# Altium schematic sheet RGB_sensro_schematic.SchDoc: RGB Sensor Schematic
size 420 x 297 mm; Date: 10-Jun-2021; Author: Yasiru Senerath Karunanayaka; DrawnBy: Yasiru Senerath Karunanayaka; Engineer: Yasiru Senerath Karunanayaka; DocumentNumber: 1; Revision: 2.0; SheetNumber: 1; SheetTotal: 1
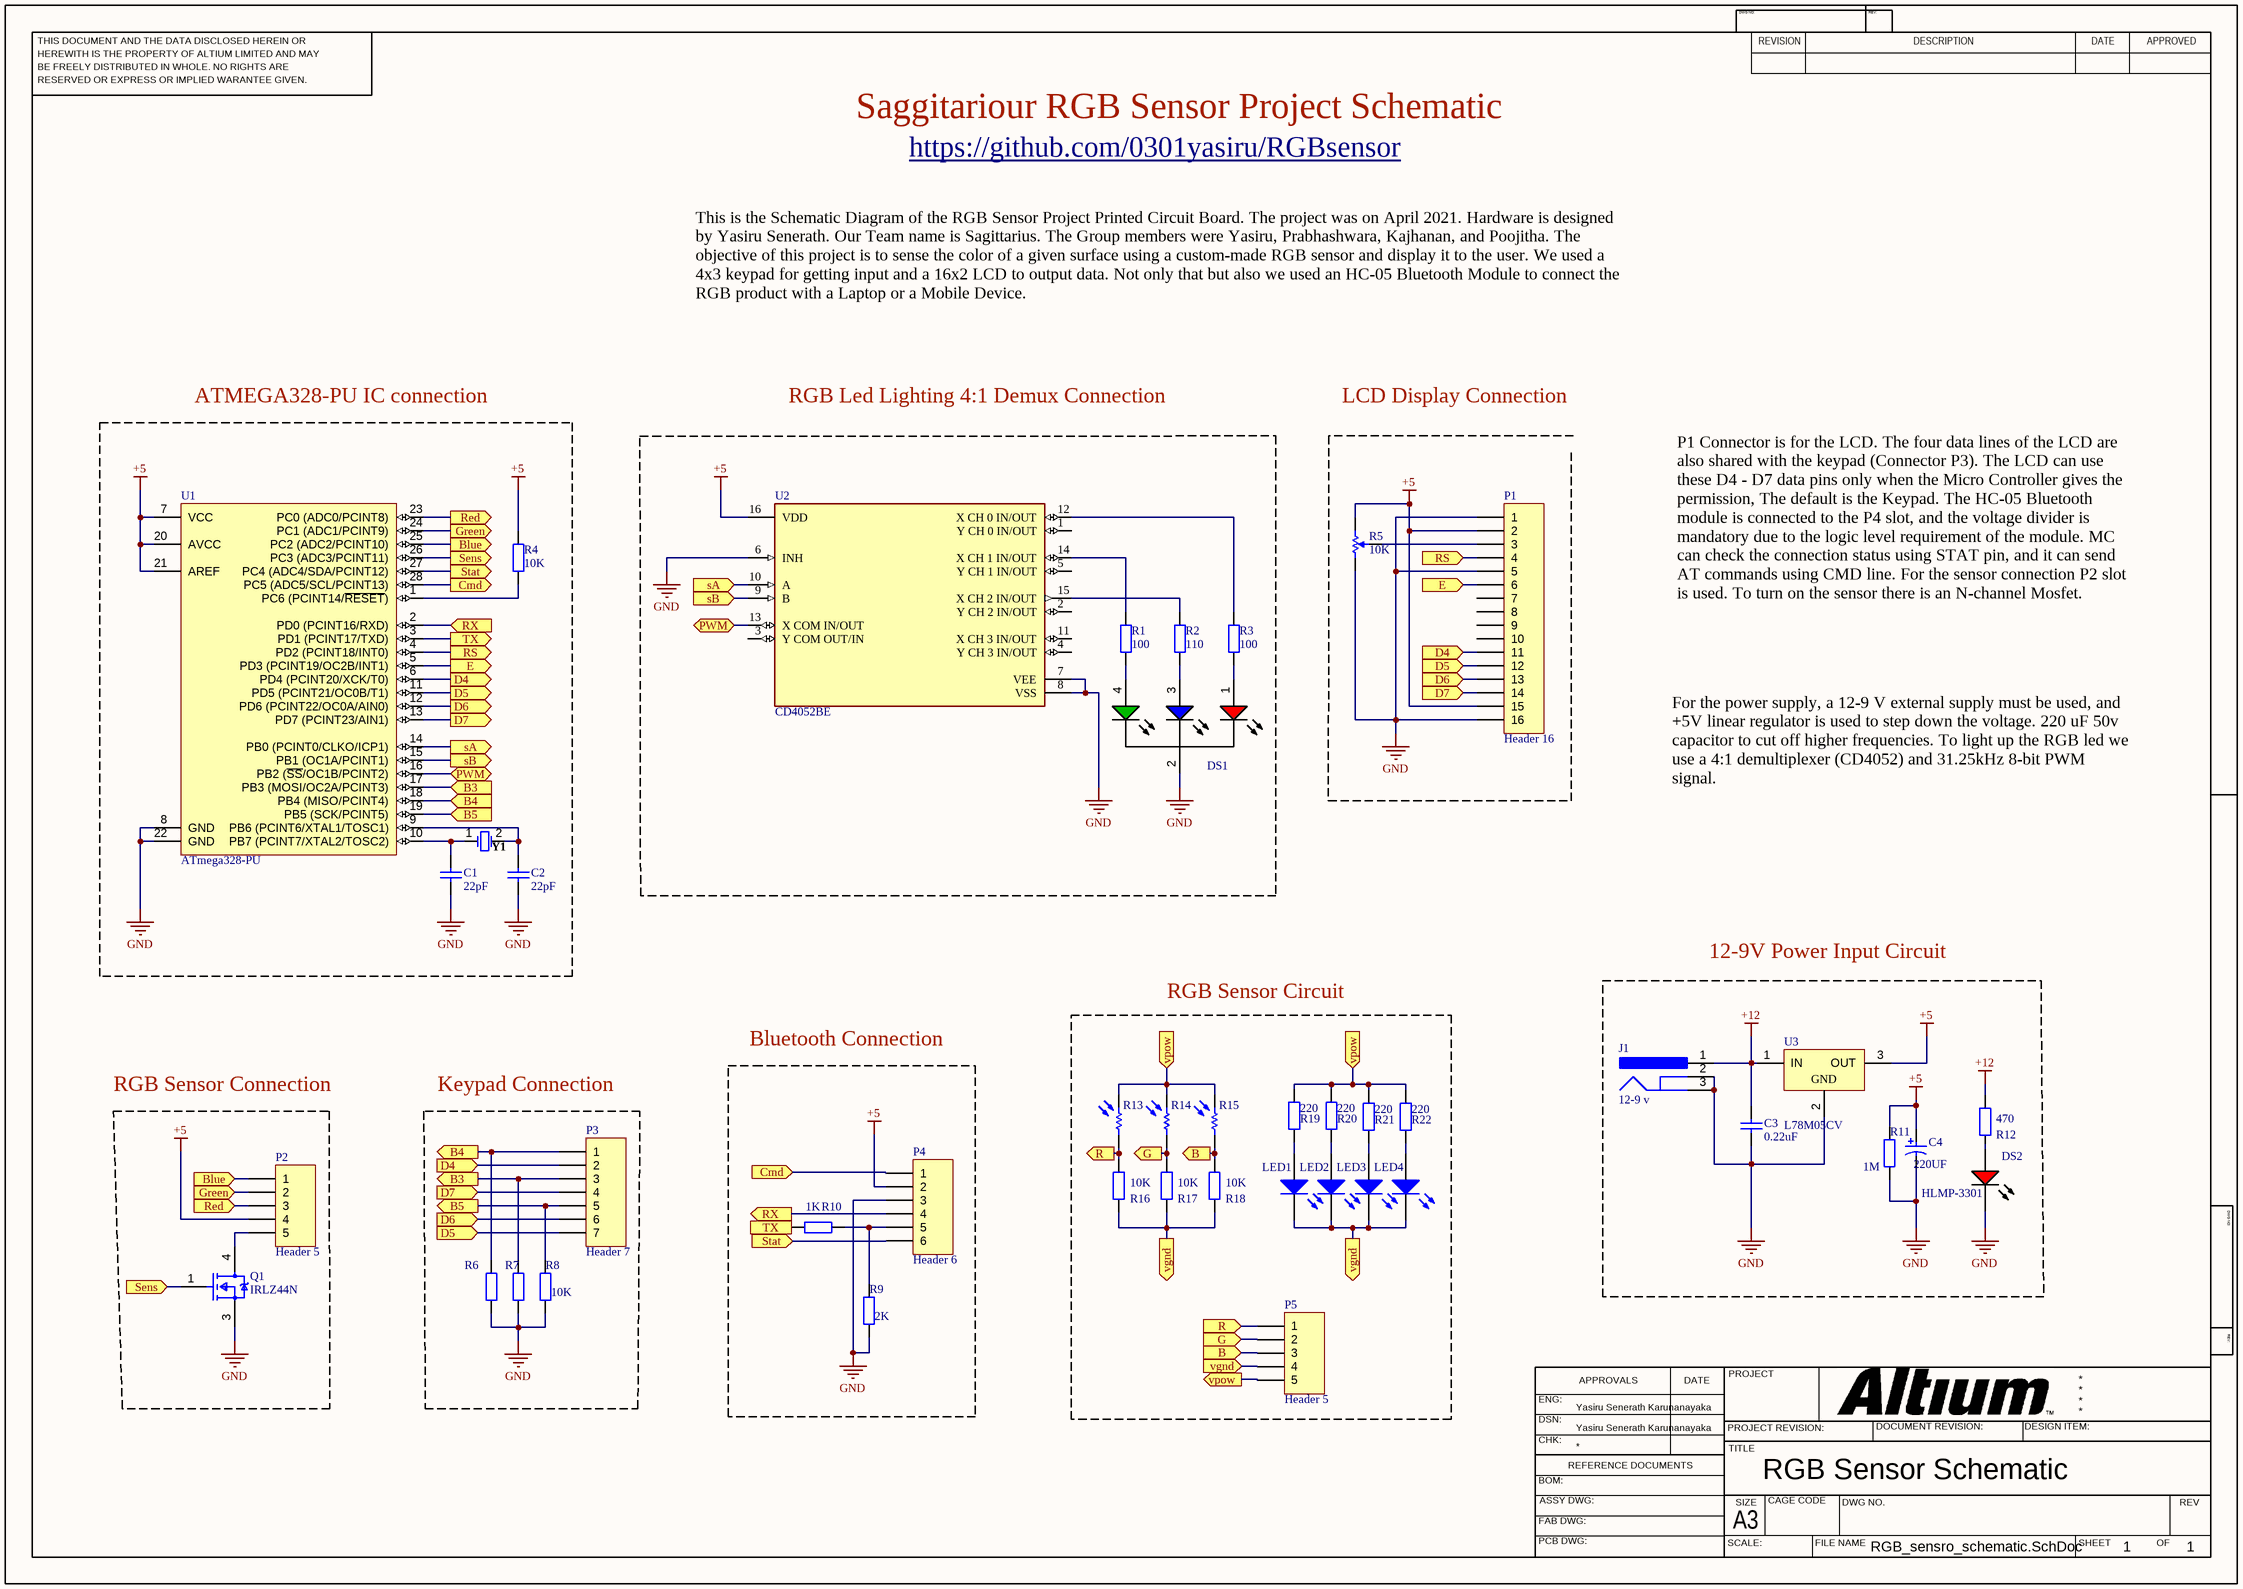
[diagram p0: RGB_sensro_schematic.SchDoc]

## Parts
C1  22pF  [KEMT-C315-THT-2]
C2  22pF  [KEMT-C315-THT-2]
C3  0.22uF  [KEMT-C315-THT-2]
C4  220UF  [PNSC-EEE-1HA221P_L]
DS1  (no value)  [KING-WP154A4SUREQBFZGC_V]
DS2  HLMP-3301  [AVAG-HLMP-3301-2]
J1  12-9 v  [LUMB-NEB21R_V]
LED1  151053RS03000  [Type 5mm]  (value not drawn)
LED2  151053RS03000  [Type 5mm]  (value not drawn)
LED3  151053RS03000  [Type 5mm]  (value not drawn)
LED4  151053RS03000  [Type 5mm]  (value not drawn)
P1  Header 16  [HDR1X16]
P2  Header 5  [HDR1X5]
P3  Header 7  [HDR1X7]
P4  Header 6  [HDR1X6]
P5  Header 5  [HDR1X5]
Q1  IRLZ44N  [FP-PG-TO263-3-MFG]
R1  100  [AXIAL-0.4]
R2  110  [AXIAL-0.4]
R3  100  [AXIAL-0.4]
R4  10K  [AXIAL-0.4]
R5  10K  [BOUR-TC33X-2_V]
R6  10K  [AXIAL-0.4]  (value not drawn)
R7  10K  [AXIAL-0.4]  (value not drawn)
R8  10K  [AXIAL-0.4]
R9  2K  [AXIAL-0.4]
R10  1K  [AXIAL-0.4]
R11  1M  [AXIAL-0.4]
R12  470  [AXIAL-0.4]
R13  VT90N1  [EXCE-VT90N1]  (value not drawn)
R14  VT90N1  [EXCE-VT90N1]  (value not drawn)
R15  VT90N1  [EXCE-VT90N1]  (value not drawn)
R16  10K  [AXIAL-0.4]
R17  10K  [AXIAL-0.4]
R18  10K  [AXIAL-0.4]
R19  220  [AXIAL-0.4]
R20  220  [AXIAL-0.4]
R21  220  [AXIAL-0.4]
R22  220  [AXIAL-0.4]
U1  ATmega328-PU  [28P3]
U2  CD4052BE  [FP-N0016A-MFG]
U3  L78M05CV  [TO220]
Y1  FOXSLF/160-20  [FOX-FOXSLF160-20]  (value not drawn)

## Blocks framed on the sheet
ATMEGA328-PU IC connection: C1 C2 R4 U1 Y1
RGB Sensor Circuit: LED1-LED4 P5 R13-R22
12-9V Power Input Circuit: C3 C4 DS2 J1 R11 R12 U3
Bluetooth Connection: P4 R9 R10
RGB Sensor Connection: P2 Q1
Keypad Connection: P3 R6-R8

## Ports
B3 (in), B3 (out), B4 (in), B4 (out), B5 (in), B5 (out), B (in), B (out), Blue (in), Blue (out), Cmd (in), Cmd (out), D4 (in), D4 (out), D5 (in), D5 (out), D6 (in), D6 (out), D7 (in), D7 (out), E (in), E (out), G (in), G (out), Green (in), Green (out), PWM (bidir), R (in), R (out), Red (in), Red (out), RS (in), RS (out), RX (in), RX (out), sA (in), sA (out), sB (in), sB (out), Sens (in), Sens (out), Stat (in), Stat (out), TX (in), TX (out), vgnd (in), vgnd (out), vpow (in), vpow (out)

## Nets
+5: C4.1 P1.2 P1.15 P2.4 P4.2 R4.2 R5.3 R11.2 U1.7(VCC) U1.20(AVCC) U1.21(AREF) U2.16(VDD) U3.3(OUT)
+12: C3.2 J1.1 R12.2 U3.1(IN)
GND: C1.1 C2.1 C3.1 C4.2 DS1.2(CATHODE) DS2.1(K) J1.2 J1.3 P1.1 P1.5 P1.16 P4.3 Q1.3(S) R5.1 R6.1 R7.1 R8.1 R9.1 R11.1 U1.8(GND) U1.22(GND) U2.6(INH) U2.7(VEE) U2.8(VSS) U3.2(GND)
B: P5.3 R15.1 R18.2 ; port B
B3: P3.3 R7.2 U1.17(PB3_(MOSI/OC2A/PCINT3)) ; port B3
B4: P3.1 R6.2 U1.18(PB4_(MISO/PCINT4)) ; port B4
B5: P3.5 R8.2 U1.19(PB5_(SCK/PCINT5)) ; port B5
Blue: P2.1 U1.25(PC2_(ADC2/PCINT10)) ; port Blue
Cmd: P4.1 U1.28(PC5_(ADC5/SCL/PCINT13)) ; port Cmd
D4: P1.11 P3.2 U1.6(PD4_(PCINT20/XCK/T0)) ; port D4
D5: P1.12 P3.7 U1.11(PD5_(PCINT21/OC0B/T1)) ; port D5
D6: P1.13 P3.6 U1.12(PD6_(PCINT22/OC0A/AIN0)) ; port D6
D7: P1.14 P3.4 U1.13(PD7_(PCINT23/AIN1)) ; port D7
E: P1.6 U1.5(PD3_(PCINT19/OC2B/INT1)) ; port E
G: P5.2 R14.1 R17.2 ; port G
Green: P2.2 U1.24(PC1_(ADC1/PCINT9)) ; port Green
PWM: U1.16(PB2_(~{SS}/OC1B/PCINT2)) U2.13(X_COM_IN/OUT) ; port PWM
R: P5.1 R13.1 R16.2 ; port R
Red: P2.3 U1.23(PC0_(ADC0/PCINT8)) ; port Red
RS: P1.4 U1.4(PD2_(PCINT18/INT0)) ; port RS
RX: P4.4 U1.2(PD0_(PCINT16/RXD)) ; port RX
sA: U1.14(PB0_(PCINT0/CLKO/ICP1)) U2.10(A) ; port sA
sB: U1.15(PB1_(OC1A/PCINT1)) U2.9(B) ; port sB
Sens: Q1.1(G) U1.26(PC3_(ADC3/PCINT11)) ; port Sens
Stat: P4.6 U1.27(PC4_(ADC4/SDA/PCINT12)) ; port Stat
TX: R10.2 U1.3(PD1_(PCINT17/TXD)) ; port TX
vgnd: LED1.1(K) LED2.1(K) LED3.1(K) LED4.1(K) P5.4 R16.1 R17.1 R18.1 ; port vgnd
vpow: P5.5 R13.2 R14.2 R15.2 R19.2 R20.2 R21.2 R22.2 ; port vpow
NetC1_2: C1.2 U1.10(PB7_(PCINT7/XTAL2/TOSC2)) Y1.1
NetC2_2: C2.2 U1.9(PB6_(PCINT6/XTAL1/TOSC1)) Y1.2
NetDS1_1: DS1.1(RED) R3.1
NetDS1_3: DS1.3(BLUE) R2.1
NetDS1_4: DS1.4(GREEN) R1.1
NetDS2_2: DS2.2(A) R12.1
NetLED1_2: LED1.2(A) R19.1
NetLED2_2: LED2.2(A) R20.1
NetLED3_2: LED3.2(A) R21.1
NetLED4_2: LED4.2(A) R22.1
NetP1_3: P1.3 R5.2
NetP2_5: P2.5 Q1.4(D)
NetP4_5: P4.5 R9.2 R10.1
NetR1_2: R1.2 U2.14(X_CH_1_IN/OUT)
NetR2_2: R2.2 U2.15(X_CH_2_IN/OUT)
NetR3_2: R3.2 U2.12(X_CH_0_IN/OUT)
NetR4_1: R4.1 U1.1(PC6_(PCINT14/~{RESET}))

Not connected (* = marked no-connect by the designer): P1 7 8 9 10; U2 1(Y_CH_0_IN/OUT) 2(Y_CH_2_IN/OUT) 3(Y_COM_OUT/IN) 4(Y_CH_3_IN/OUT) 5(Y_CH_1_IN/OUT) 11(X_CH_3_IN/OUT)

## Notes on the sheet
- Saggitariour RGB Sensor Project Schematic
- https://github.com/0301yasiru/RGBsensor
- This is the Schematic Diagram of the RGB Sensor Project Printed Circuit Board. The project was on April 2021. Hardware is designed by Yasiru Senerath. Our Team name is Sagittarius. The Group members were Yasiru, Prabhashwara, Kajhanan, and Poojitha. The objective of this project is to sense the color of a given surface using a custom-made RGB sensor and display it to the user. We used a 4x3 keypad for getting input and a 16x2 LCD to output data. Not only that but also we used an HC-05 Bluetooth Module to connect the RGB product with a Laptop or a Mobile Device.
- RGB Led Lighting 4:1 Demux Connection
- LCD Display Connection
- P1 Connector is for the LCD. The four data lines of the LCD are also shared with the keypad (Connector P3). The LCD can use these D4 - D7 data pins only when the Micro Controller gives the permission, The default is the Keypad. The HC-05 Bluetooth module is connected to the P4 slot, and the voltage divider is mandatory due to the logic level requirement of the module. MC can check the connection status using STAT pin, and it can send AT commands using CMD line. For the sensor connection P2 slot is used. To turn on the sensor there is an N-channel Mosfet.
- For the power supply, a 12-9 V external supply must be used, and +5V linear regulator is used to step down the voltage. 220 uF 50v capacitor to cut off higher frequencies. To light up the RGB led we use a 4:1 demultiplexer (CD4052) and 31.25kHz 8-bit PWM signal.
- THIS DOCUMENT AND THE DATA DISCLOSED HEREIN OR
- HEREWITH IS THE PROPERTY OF ALTIUM LIMITED AND MAY
- DWG NO:
- REVISION
- REV:
- DESCRIPTION
- DATE
- APPROVED
- BE FREELY DISTRIBUTED IN WHOLE. NO RIGHTS ARE
- RESERVED OR EXPRESS OR IMPLIED WARANTEE GIVEN.
- ENG:
- APPROVALS
- PROJECT
- DSN:
- CHK:
- REFERENCE DOCUMENTS
- PROJECT REVISION:
- TITLE
- DOCUMENT REVISION:
- DESIGN ITEM:
- BOM:
- FAB DWG:
- PCB DWG:
- ASSY DWG:
- SCALE:
- A3
- SIZE
- CAGE CODE
- FILE NAME
- DWG NO.
- SHEET
- OF
- REV

## Library data of the parts
C1-C3 = CMP-1664-00008-1: Capacitor, Ceramic, 22 pF, +/-10 %, 100 V, -55 to 125 degC, 2-Pin THD, RoHS, Bulk; Max Input Voltage: 40 V; Min Input Voltage: 4.2 V; Output Current: 1.5 A; Output Voltage: 1.2 V; Outputs: 1; Case\Package: TO-220; RoHSCompliant: true; Min Operating Temperature: 0 degC; Max Operating Temperature: 125 degC; Package Quantity: 50; ComponentLink2URL: http://capacitoredge.kemet.com/capedge2/DataSheet/Datasheet-C315C220K1G5TA.pdf?pn=C315C220K1G5TA{BULK}; Radiation Hardening: No; Pins: 3; Length: 10.28 mm; ComponentLink1URL: http://www.kemet.com/; ComponentLink2Description: Datasheet; Height: 9.28 mm; REACH SVHC: No SVHC; ComponentLink1Description: Manufacturer URL; Max Ouput Current: 1.5 A; Weight: 0.08113 oz; Packaging: Rail/Tube; DatasheetVersion: Aug-16; Mount: Through Hole; PackageReference: C315-THT-2; Width: 4.82 mm; PackageDescription: 2-Pin Through Hole Device, Body 3.81 x 2.54 mm
C4 = CMP-2000-06200-1: Aluminum Electrolytic Capacitor, 220 uF, +/- 20%, 50 V, -40 to 85 degC, 2-Pin SMD, RoHS, Tape and Reel; Manufacturer: Panasonic; Lifetime @ Temperature: 2000hours@85°C; AE Capacitor Case: RadialCan-SMD; Capacitance: 220µF; Ripple Current AC: 300mA; SVHC: ToBeAdvised; Voltage Rating: 50V; Product Range: PANASONIC-SSeries; Datasheet Version: 11/2012; Manufacturer URL: http://www.panasonic.com/; Packaging: CutTape; Life Time @ Temperature: 2000hours@85°C; Capacitor Case Style: RadialCan-SMD; Capacitance Tolerance ±: ±20%; Mounting Technology: SurfaceMount; Operating Temperature Max: 85°C; Capacitance Tolerance: ±20%; Package Description: 2-Pin Surface Mount Device, Body 10.3 x 10.3 mm; Package Reference: SMD; Diameter: 10mm; Height: 10.2mm; Operating Temperature Min: -40°C; Datasheet URL: http://datasheet.octopart.com/EEE-1HA221P-Panasonic-datasheet-13265900.pdf
DS1 = CMP-2000-07415-1: Full Color LED Lamp, Dominant Wavelength RGB 630 / 525 / 465 nm, -40 to 85 degC, 4-Pin THD, RoHS; Manufacturer: Kingbright; Viewing Angle: 50°; Wavelength - Dominant: 630nm,525nm,465nm; Online Catalog: 5mm,T-13/4(RGB)RoundwithDomedTopLEDLamp; Millicandela Rating: 1300mcdRed,1700mcdGreen,900mcdBlue; Other Names: 754-1615 / WP154A4SUREQBFZGC-ND; Current - Test: 20mA; Wavelength - Peak: 645nm,515nm,460nm; Color: Red,Green,Blue(RGB); Voltage - Forward (Vf) (Typ): 1.9VRed,3.3VGreen,3.3VBlue; Lens Type: Clear; 3D Model: WP154A4SUREQBFZGW.sldprt / WP154A4SUREQBFZGW.pro / WP154A4SUREQBFZGW.igs / WP154A4SUREQBFZGW.stp; Lens Style/Size: RoundwithDomedTop,5mm,T-13/4; Packaging: Bulk; Datasheet URL: https://www.kingbrightusa.com/images/catalog/spec/WP154A4SUREQBFZGC.pdf; Family: LEDIndication-Discrete; Datasheet Version: Rev. 5A, 08/2014; Category: Optoelectronics; Manufacturer URL: http://www.kingbright.com/; Height: 8.60mm; Mounting Type: ThroughHole; Package Reference: WP154A4SUREQBFZGC; Mounting Technology: ThroughHole; Package Description: 4-Pin Through Hole LED, Dia 5.9 mm, Pitch 1.27 mm; Standard Package: 500; Package / Case: Radial-4Leads
DS2 = CMP-2000-06411-1: T-1 3/4 (5 mm) Diffused LED Lamp, 1.9 V, -40 to 100 degC, 2-Pin THD, RoHS, Bulk; Manufacturer: Avago; Forward Current: 25mA; Forward Voltage: 2.4V; Peak Wavelength: 635nm; Shape Type: Circular; High Brightness: No; Main Category: StandardLED; Test Current (It): 10mA; Dominant Wave Length: 626nm; Number of  Elements: 1; Reverse Voltage: 5V; Chip Material: GaP; Product Height (mm): 9.19mm; Lens Type: ColoredDiffused; Viewing Angle: 60deg; Type: Uni-Color; Emitting Color: Red; Luminous Intensity: 5.4mcd; Power Dissipation: 85W; DELETED: Compliant; Product Depth (mm): 6.1mm; Package Description: 2-Pin Through Hole LED, Dia 5.85 mm; Mounting Technology: ThroughHole; Manufacturer URL: http://www.avagotech.com/; Package Type: T-13/4; Operating Temp Range: -40Cto100C; Datasheet URL: http://www.avagotech.com/docs/AV02-1558EN; Mounting: ThroughHole; Lens Dimensions: 5.08x5.08x8.3mm; Package Reference: HLMP-3301; Datasheet Version: 03/2015; Pin Count: 2; Packaging: TapeandReel; Operating Temperature Classification: Industrial; Lum Intensity: 5.4mcd; Rad Hardened: No; Product Length (mm): 6.1mm
J1 = CMP-2000-06841-1: Jack Socket, Body 14.5 x 9 mm, Height 11 mm, -20 to 70 degC, 3-Pin THD, RoHS, Bulk; Manufacturer: Lumberg; Body Orientation: RightAngle; Voltage Rating: 12Vdc; Current Rating: 3A; Maximum Operating Temperature: +70°C; Mounting Technology: ThroughHole; Termination Method: Solder; Package Description: 3-Pin Through Hole Device, Body 14.5 x 9 mm, Height 11 mm; Datasheet URL: https://datasheet.ciiva.com/11720/0900766b805694d6-11720273.pdf; Datasheet Version: 12/2004; Package Reference: NEB21R; Manufacturer URL: http://www.lumberg.com/; Plug/Socket: Socket; Mounting Type: ThroughHole; Minimum Operating Temperature: -20°C
LED1-LED4 = CMP-1489-00007-1: THT LED round mono-color waterclear,  WL-TMRW ,Red; Manufacturer: Wuerth Elektronik; PackageReference: Type 5mm; PartNumber: 151053RS03000; ComponentLink1URL: http://www.we-online.com; ComponentLink2Description: Datasheet; Emitting color: Red; ComponentLink2URL: http://katalog.we-online.de/pbs/datasheet/7448042001.pdfhttp://katalog.we-online.de/pbs/datasheet/7448042001.pdfhttp://katalog.we-online.de/pbs/datasheet/7448042001.pdfhttp://katalog.we-online.de/pbs/datasheet/151053RS03000.pdf; ComponentLink1Description: Manufacturer URL
P1 = Header 16: Header, 16-Pin; LatestRevisionDate: 17-Jul-2002; LatestRevisionNote: Re-released for DXP Platform.; Publisher: Altium Limited
P2 P5 = Header 5: Header, 5-Pin; LatestRevisionDate: 17-Jul-2002; LatestRevisionNote: Re-released for DXP Platform.; Publisher: Altium Limited
P3 = Header 7: Header, 7-Pin; LatestRevisionDate: 17-Jul-2002; LatestRevisionNote: Re-released for DXP Platform.; Publisher: Altium Limited
P4 = Header 6: Header, 6-Pin; LatestRevisionDate: 17-Jul-2002; LatestRevisionNote: Re-released for DXP Platform.; Publisher: Altium Limited
Q1 = CMP-32901-000495-1: MOSFET N-CH 55V 47A D2PAK; Rds On Max: 22mR; Input Capacitance: 1.7nF; Turn-On Delay Time: 11ns; Turn-Off Delay Time: 26ns; Power Dissipation: 110W; Element Configuration: Single; Gate to Source Voltage (Vgs): 16V; Drain to Source Resistance: 35mR; Threshold Voltage: 2V; Max Power Dissipation: 3.8W; Lead Free: Contains Lead; Max Dual Supply Voltage: 55V; Width: 0.38inch; Mount: Surface Mount; Continuous Drain Current (ID): 47A; Min Operating Temperature: -55°C; Number of Pins: 3; REACH SVHC: No SVHC; Height: 0.19inch; Length: 0.42inch; Case/Package: D2PAK; Drain to Source Breakdown Voltage: 55V; Packaging: Tape and Reel; Drain to Source Voltage (Vdss): 55V; Halogen Free: Halogen Free; RoHS Compliant: Yes; Max Operating Temperature: 175°C
R1-R4 R6-R12 R16-R22 = Res2: Resistor; Published: 8-Jun-2000; LatestRevisionDate: 17-Jul-2002; LatestRevisionNote: Re-released for DXP Platform.; PackageReference: AXIAL-0.4; Publisher: Altium Limited; PackageDescription: Axial Device, Thru-Hole; 2 Leads; 0.4 in Pin Spacing
  R1 R3: Value: 100
  R2: Value: 110
  R4 R6-R8 R16-R18: Value: 10K
  R9: Value: 2K
  R10: Value: 1K
  R11: Value: 1M
  R12: Value: 470
  R19-R22: Value: 220
R5 = CMP-2100-03695-1: Trimming Potentiometer, 10000 Ohm, -40 to 100 degC, 3-Pin SMD, RoHS, Tape and Reel; Manufacturer: Bourns; Tolerance: 25%; Max Power Dissipation: 100mW; Number of Turns: 1; Resistance: 10KOhm; Temperature Coefficient: 250ppm/degreesC; Voltage Rating (DC): 50V; Datasheet URL: http://www.bourns.com/docs/Product-Datasheets/TC33.pdf; Composition: Potentiometer; Package Description: 3-Pin Surface Mount Device, Body 3.8 x 3.6 mm; Weight: 29.4mg; Power Rating: 100mW; Termination: FootPrint; Manufacturer URL: http://www.bourns.com/; Width: 0.118inch; Height: 0.047inch; Military Standard: Not; Radiation Hardening: No; Colour: Silver; Case/Package: SMD/SMT; Depth: 3.8mm; Min Operating Temperature: -40degC; Lead Free: LeadFree; Datasheet Version: 42583.0; REACH SVHC: NoSVHC; Length: 3mm; RoHSCompliant: true; Contact Plating: Silver; Taper: Linear; Packaging: TapeandReel; Mount: SurfaceMount; Max Operating Temperature: 100degC; Package Reference: TC33X-2; Package Quantity: 2500
R13-R15 = CMP-2000-07406-1: Photoconductive Resistor, 200 kOhm, 100 V, 80 mW, -40 to 75 degC, 2-Pin THD, RoHS; Manufacturer: Excelitas Technology; SVHC: Cadmiumchloride(15-Jun-2015); Power Rating: 80mW; Resistance @ Lux: 12kohm; Voltage Rating: 100V; Product Range: -; Datasheet Version: 09/2006; Resistor Case Style: -; Operating Temperature Max: 75°C; Package Reference: VT90N1; Datasheet URL: http://datasheet.octopart.com/VT90N1-Excelitas-datasheet-10388451.pdf; Mounting Technology: ThroughHole; Operating Temperature Min: -40°C; Dark Resistance: 200kohm; Package Description: 2-Pin Through Hole Device, Body Width 4.17 mm (Max), Height 2.29 mm; Manufacturer URL: http://www.excelitas.com/Pages/Index.aspx; Packaging: Each
U1 = CMP-0095-00015-2: 8-bit AVR Microcontroller, 32KB Flash, 1KB EEPROM, 2KB SRAM, 28-pin PDIP, Industrial Grade (-40°C to 85°C); ComponentLink3Description: ATmega48A/48PA/88A/88PA/168A/168PA/328/328P Summary; RevisionNote: DatasheetVersion updated. URLs added.; DatasheetVersion: revD, May-2011; ComponentLink1URL: http://www.atmel.com/; PackageVersion: revB, Sep-2001; PackageDescription: 28-lead (0.300"/7.62mm Wide) Plastic Dual Inline Package (PDIP); PackageReference: 28P3; ComponentLink1Description: Manufacturer URL; ComponentLink2Description: ATmega48A/48PA/88A/88PA/168A/168PA/328/328P Datasheet; ComponentLink3URL: http://www.atmel.com/dyn/resources/prod_documents/8271S.pdf; ComponentLink2URL: http://www.atmel.com/dyn/resources/prod_documents/8271.pdf
U2 = CMP-1575-00066-5: IC MUX/DEMUX DUAL 4X1 16DIP; Bandwidth: 25MHz; Turn-Off Delay Time: 450ns; Number of Channels: 2; Min Supply Voltage: 3V; Number of Inputs: 8; Min Dual Supply Voltage: 2.5V; Number of Terminals/Pins: 16; Supply Type: Single; Max Dual Supply Voltage: 9V; Operating Supply Current: 80nA; Number of Bits: 4; Max Supply Voltage: 20V; Turn-On Delay Time: 720ns; Polarity: Non-Inverting; Propagation Delay: 60ns; Operating Supply Voltage: 18V; Logic Function: Multiplexer; Throw Configuration: SP4T; On-State Resistance: 240R; Number of Circuits: 2; Weight: 0.03357oz; REACH SVHC: No SVHC; Mount: Through Hole; Packaging: Rail/Tube; Width: 7.62mm; RoHS Compliant: Yes; Radiation Hardening: No; Lead Free: Lead Free; Nominal Supply Current: 80nA; Number of Outputs: 2; Package Quantity: 25; Quiescent Current: 80nA; Min Operating Temperature: -55°C; Number of Pins: 16; Contact Plating: Gold; Case/Package: PDIP; Max Input Voltage: 20V; Max Operating Temperature: 125°C
U3 = CMP-0244-00437-1: Positive Voltage Regulator, 5V, 3-Pin TO-220; ComponentLink1Description: Manufacturer URL; PackageReference: TO220; ComponentLink1URL: http://www.st.com; PackageVersion: ver3.0; ComponentLink3Description: Package Specification; ComponentLink2URL: http://www.st.com/internet/com/TECHNICAL_RESOURCES/TECHNICAL_LITERATURE/DATASHEET/CD00000447.pdf; PackageDescription: TO, Thru-Hole, Vertical, Heatsink Mounted; 3 In-Line Leads; Pitch 2.54 mm; DatasheetVersion: 1/11/2010; ComponentLink3URL: http://www.st.com/internet/com/TECHNICAL_RESOURCES/TECHNICAL_LITERATURE/PACKAGE_INFORMATION/CD00004649.pdf; ComponentLink2Description: Datasheet
Y1 = CMP-1749-00003-1: Resistance Weld Thru-Hole Crystal, 16 MHz, -20 to 70 degC, 2-Pin THD, RoHS, Bulk; Voltage Rating: 250 V; Tolerance: 1%; Resistance: 221 kohm; Case\Package: Axial; Power Rating: 250 mW; RoHSCompliant: true; Package Quantity: 200; Packaging: Bulk; Min Operating Temperature: -55 degC; DatasheetVersion: Mar-15; ComponentLink1URL: http://www.foxonline.com/; Max Operating Temperature: 155 degC; PackageReference: FOXSLF160-20; Mount: Through Hole; PackageDescription: 2-Pin Through Hole Device, Body 11.35 x 4.65 mm; ComponentLink1Description: Manufacturer URL; ComponentLink2URL: http://www.foxonline.com/pdfs/hc49slf.pdf; ComponentLink2Description: Datasheet; Length: 0.248 inch